# Altium schematic sheet 02_POWER.SchDoc
size A4; SheetNumber: 2; SheetTotal: 4
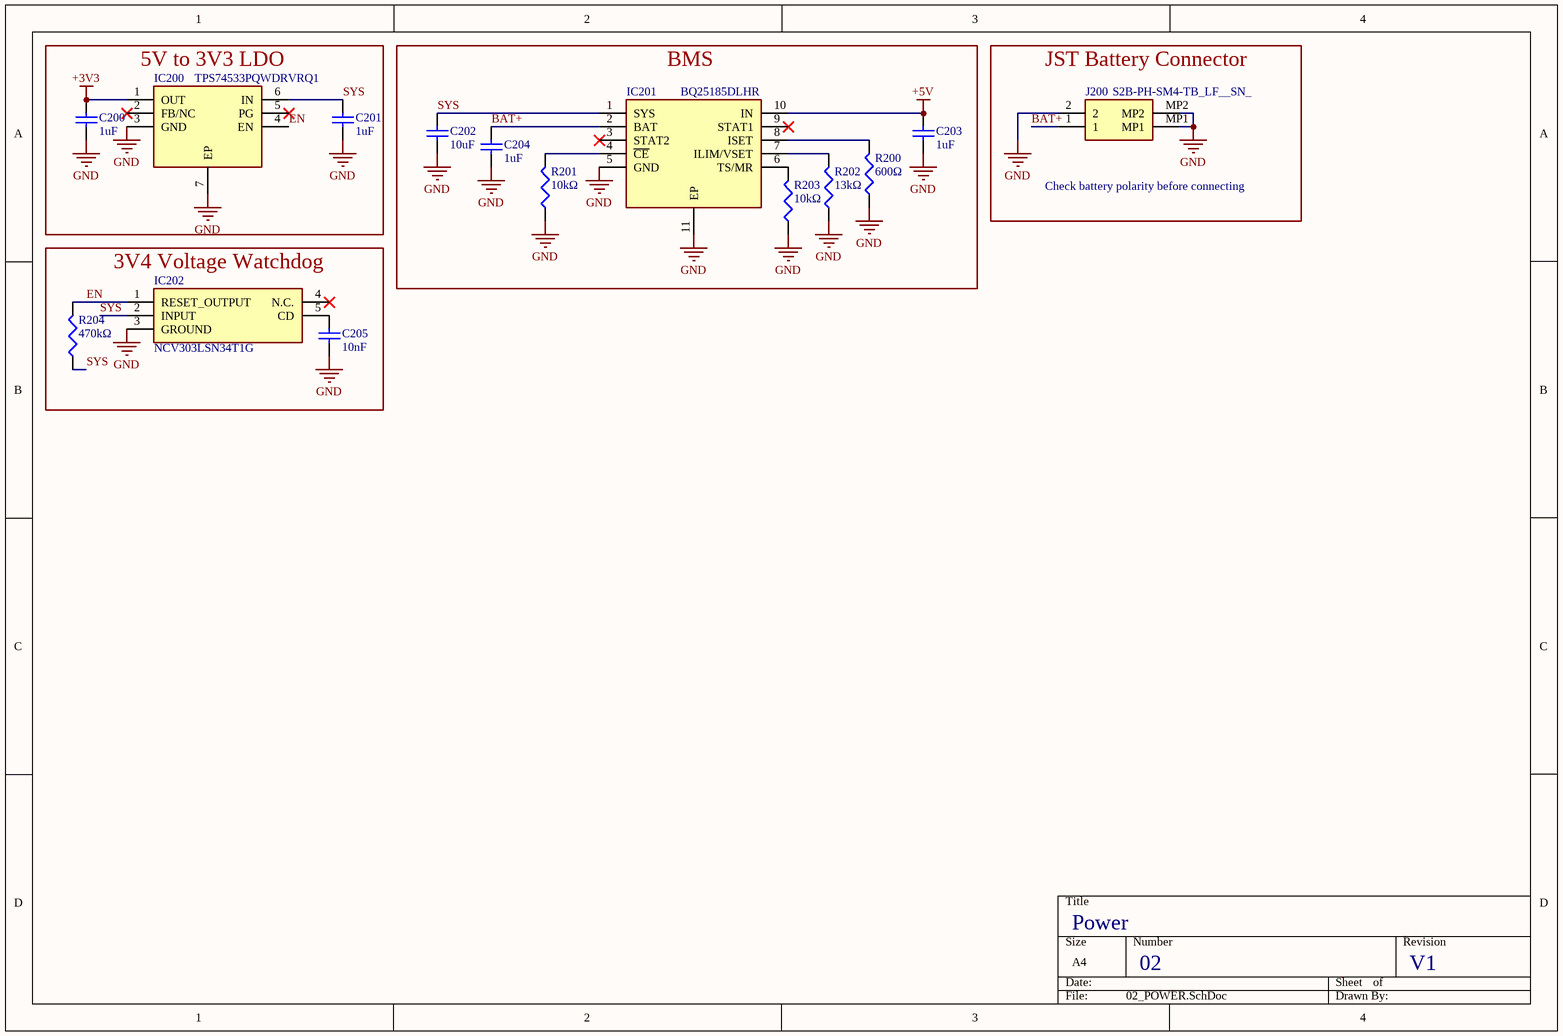
[diagram p0: 02_POWER.SchDoc]

## Parts
C200  value 1uF  [CAPC1005X55X25LL05T10]  (hidden comment: Capacitor 1 uF +/- 10% 6.3 V 0402)
C201  value 1uF  [CAPC1005X55X25LL05T10]  (hidden comment: Capacitor 1 uF +/- 10% 6.3 V 0402)
C202  value 10uF  [CAPC1005X55X25LL05T10]  (hidden comment: Capacitor 1 uF +/- 10% 6.3 V 0402)
C203  value 1uF  [CAPC1005X55X25LL05T10]  (hidden comment: Capacitor 1 uF +/- 10% 6.3 V 0402)
C204  value 1uF  [CAPC1005X55X25LL05T10]  (hidden comment: Capacitor 1 uF +/- 10% 6.3 V 0402)
C205  value 10nF  [CAPC1005X55X25LL05T10]  (hidden comment: Capacitor 1 uF +/- 10% 6.3 V 0402)
IC200  TPS74533PQWDRVRQ1  [SON65P200X200X80-7N]
IC201  BQ25185DLHR  [SON40P220X200X80-11N]
IC202  NCV303LSN34T1G  [SOT95P275X110-5N]
J200  S2B-PH-SM4-TB_LF__SN_  [S2BPHSM4TBLFSN]
R200  value 600Ω  [RESC0402(1005)_L]  (hidden comment: 100R2F)
R201  value 10kΩ  [RESC0402(1005)_L]  (hidden comment: 100R2F)
R202  value 13kΩ  [RESC0402(1005)_L]  (hidden comment: 100R2F)
R203  value 10kΩ  [RESC0402(1005)_L]  (hidden comment: 100R2F)
R204  value 470kΩ  [RESC0402(1005)_L]  (hidden comment: 100R2F)

## Blocks framed on the sheet
5V to 3V3 LDO: C200 C201 IC200
BMS: C202-C204 IC201 R200-R203
JST Battery Connector: J200
3V4 Voltage Watchdog: C205 IC202 R204

## Nets
+3V3: C200.2 IC200.1(OUT)
+5V: C203.2 IC201.10(IN)
GND: C200.1 C201.1 C202.1 C203.1 C204.1 C205.1 IC200.3(GND) IC200.7(EP) IC201.5(GND) IC201.11(EP) IC202.3(GROUND) J200.2 J200.MP1 J200.MP2 R200.1 R201.1 R202.1 R203.1
BAT+: C204.2 IC201.2(BAT) J200.1
EN: IC200.4(EN) IC202.1(RESET_OUTPUT) R204.2
SYS: C201.2 C202.2 IC200.6(IN) IC201.1(SYS) IC202.2(INPUT) R204.1
NetC205_2: C205.2 IC202.5(CD)
NetIC201_4: IC201.4(~{CE}) R201.2
NetIC201_6: IC201.6(TS/MR) R203.2
NetIC201_7: IC201.7(ILIM/VSET) R202.2
NetIC201_8: IC201.8(ISET) R200.2

Not connected (* = marked no-connect by the designer): IC200 2(FB/NC)* 5(PG)*; IC201 3(STAT2)* 9(STAT1)*; IC202 4(N.C.)*

## Notes on the sheet
- Check battery polarity before connecting
- Power
- 02
- V1

## Library data of the parts
C200-C205 = CMP-001-00008-6: Chip Capacitor, 1 uF, +/- 10%, 6.3 V, 0402 (1005 Metric); Capacitor Type: Ceramic; Voltage Rating: 6.3V; Max Operating Temperature: 85°C; Mounting Technology: SM; Tolerance: 10%; Case/Package: 0402; RoHS Compliant: True; Min Operating Temperature: -55°C; Pins: 2
IC200 = TPS74533PQWDRVRQ1: Integrated Circuit; Manufacturer_Name: Texas Instruments; Datasheet Link: https://www.ti.com/lit/gpn/TPS745-Q1; Height: 0.8mm; Manufacturer_Part_Number: TPS74533PQWDRVRQ1; Mouser Part Number: 595-PS74533PQWDRVRQ1; Mouser Price/Stock: https://www.mouser.co.uk/ProductDetail/Texas-Instruments/TPS74533PQWDRVRQ1?qs=%252B6g0mu59x7KMjoigNjBCww%3D%3D
IC201 = BQ25185DLHR: Integrated Circuit; Manufacturer_Name: Texas Instruments; Datasheet Link: https://www.ti.com/lit/ds/symlink/bq25185.pdf?ts=1706857561339&ref_url=https%253A%252F%252Fwww.ti.com%252Fproduct%252FBQ25185; Height: 0.8mm; Manufacturer_Part_Number: BQ25185DLHR; Mouser Part Number: 595-BQ25185DLHR; Mouser Price/Stock: https://www.mouser.co.uk/ProductDetail/Texas-Instruments/BQ25185DLHR?qs=Z%252BL2brAPG1IbO%2FV3RqsaPw%3D%3D
IC202 = NCV303LSN34T1G: Integrated Circuit; Manufacturer_Name: onsemi; Datasheet Link: https://www.onsemi.com/pub/Collateral/NCP302-D.PDF; Height: 1.1mm; Manufacturer_Part_Number: NCV303LSN34T1G; Mouser Part Number: 863-NCV303LSN34T1G; Mouser Price/Stock: https://www.mouser.com/Search/Refine.aspx?Keyword=863-NCV303LSN34T1G; Arrow Part Number: NCV303LSN34T1G; Arrow Price/Stock: https://www.arrow.com/en/products/ncv303lsn34t1g/on-semiconductor.html?utm_currency=USD&region=europe
J200 = S2B-PH-SM4-TB_LF__SN_: Connector; Manufacturer_Name: JST (JAPAN SOLDERLESS TERMINALS); Manufacturer_Part_Number: S2B-PH-SM4-TB(LF)(SN); Datasheet Link: https://www.jst-mfg.com/product/pdf/eng/ePH.pdf; Height: 6.6mm; Mouser Part Number: N/A; Mouser Price/Stock: https://www.mouser.co.uk/ProductDetail/JST-Commercial/S2B-PH-SM4-TBLFSN?qs=QpmGXVUTftEA9IU90i0xlg%3D%3D; Arrow Part Number: S2B-PH-SM4-TB(LF)(SN); Arrow Price/Stock: https://www.arrow.com/en/products/s2b-ph-sm4-tb-lf-sn/jst-manufacturing?utm_currency=USD&region=europe; ComponentLink1Description: DigiKey; ComponentLink1URL: https://www.digikey.ca/en/products/detail/jst-sales-america-inc/S2B-PH-SM4-TB/926655; ComponentLink2Description: Battery; ComponentLink2URL: https://www.amazon.ca/4200mah-Rechargeable-Lithium-Replacement-Electronic/dp/B091Y3TW9F?sr=8-6
R200-R204 = CMP-009-00065-2: 100R 0.063W 1% 0402 (1005 Metric)  SMD; Power: 63mW; Tolerance: 1%; Case/Package: 0402; Pins: 2; Mounting Technology: SMT